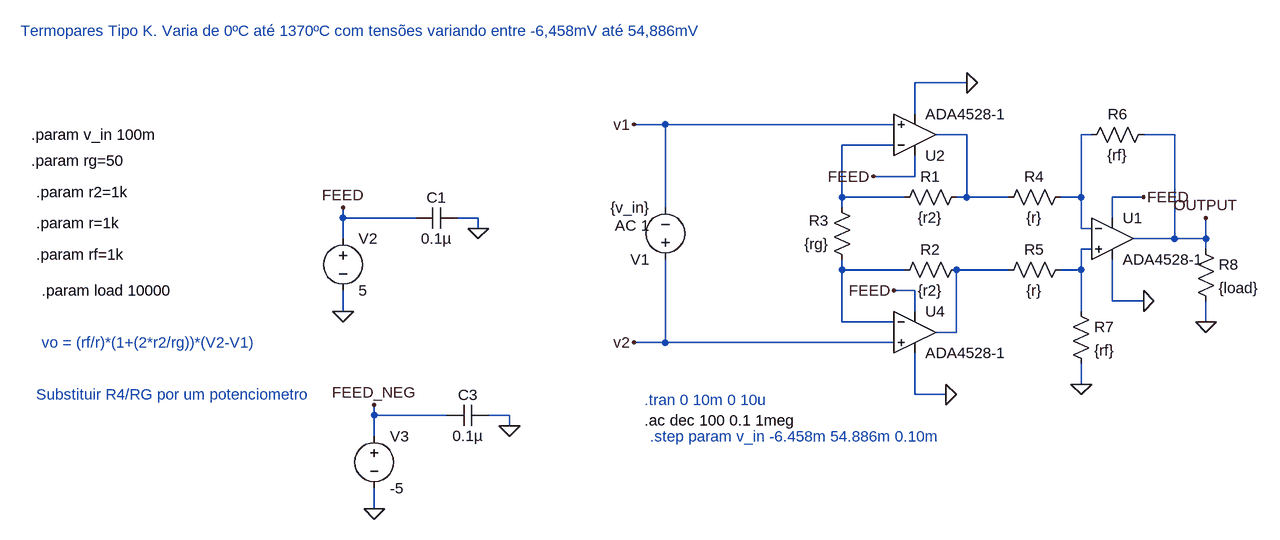
[diagram p0: schematic Amplificador_Instrumentacao_ADA4528_1.asc]
Amplificador_Instrumentacao_ADA4528_1.asc, the LTspice schematic file:
Version 4.1
SHEET 1 1372 680
WIRE 384 -160 304 -160
WIRE 304 -112 304 -160
WIRE -80 -96 -128 -96
WIRE 272 -96 -80 -96
WIRE 384 -80 336 -80
WIRE 576 -80 560 -80
WIRE 704 -80 656 -80
WIRE 272 -64 192 -64
WIRE 304 -16 304 -48
WIRE 304 -16 240 -16
WIRE 192 16 192 -64
WIRE 288 16 192 16
WIRE 384 16 384 -80
WIRE 384 16 368 16
WIRE 448 16 384 16
WIRE 560 16 560 -80
WIRE 560 16 528 16
WIRE 656 16 608 16
WIRE -80 32 -80 -96
WIRE 192 32 192 16
WIRE -576 48 -576 32
WIRE -464 48 -576 48
WIRE -368 48 -400 48
WIRE 608 48 608 16
WIRE -368 64 -368 48
WIRE 560 64 560 16
WIRE 576 64 560 64
WIRE -576 80 -576 48
WIRE 704 80 704 -80
WIRE 704 80 640 80
WIRE 752 80 752 48
WIRE 752 80 704 80
WIRE 576 96 560 96
WIRE 752 96 752 80
WIRE 192 128 192 112
WIRE 288 128 192 128
WIRE 448 128 368 128
WIRE 560 128 560 96
WIRE 560 128 528 128
WIRE 304 160 272 160
WIRE 608 176 608 112
WIRE 656 176 608 176
WIRE -576 192 -576 160
WIRE 304 192 304 160
WIRE 560 192 560 128
WIRE 192 208 192 128
WIRE 272 208 192 208
WIRE 752 208 752 176
WIRE 368 224 368 128
WIRE 368 224 336 224
WIRE -80 240 -80 112
WIRE -80 240 -128 240
WIRE 272 240 -80 240
WIRE 560 304 560 272
WIRE 304 320 304 256
WIRE 352 320 304 320
WIRE -528 352 -528 336
WIRE -416 352 -528 352
WIRE -320 352 -352 352
WIRE -320 368 -320 352
WIRE -528 384 -528 352
WIRE -528 496 -528 464
FLAG -576 32 FEED
FLAG -576 192 0
FLAG 560 304 0
FLAG 240 -16 FEED
FLAG 272 160 FEED
FLAG 656 16 FEED
FLAG 752 208 0
FLAG 752 48 OUTPUT
FLAG -128 240 v2
FLAG -128 -96 v1
FLAG -368 64 0
FLAG -528 336 FEED_NEG
FLAG -528 496 0
FLAG -320 368 0
FLAG 656 176 0
FLAG 352 320 0
FLAG 384 -160 0
SYMBOL res 384 0 R90
WINDOW 0 0 56 VBottom 2
WINDOW 3 32 56 VTop 2
SYMATTR InstName R1
SYMATTR Value {r2}
SYMBOL res 384 112 R90
WINDOW 0 0 56 VBottom 2
WINDOW 3 32 56 VTop 2
SYMATTR InstName R2
SYMATTR Value {r2}
SYMBOL res 208 128 R180
WINDOW 0 36 76 Left 2
WINDOW 3 36 40 Left 2
SYMATTR InstName R3
SYMATTR Value {rg}
SYMBOL res 432 32 R270
WINDOW 0 32 56 VTop 2
WINDOW 3 0 56 VBottom 2
SYMATTR InstName R4
SYMATTR Value {r}
SYMBOL res 432 144 R270
WINDOW 0 32 56 VTop 2
WINDOW 3 0 56 VBottom 2
SYMATTR InstName R5
SYMATTR Value {r}
SYMBOL res 560 -64 R270
WINDOW 0 32 56 VTop 2
WINDOW 3 0 56 VBottom 2
SYMATTR InstName R6
SYMATTR Value {rf}
SYMBOL res 544 176 R0
SYMATTR InstName R7
SYMATTR Value {rf}
SYMBOL voltage -80 128 R180
WINDOW 123 24 68 Left 2
WINDOW 39 0 0 Left 0
SYMATTR Value2 AC 1
SYMATTR InstName V1
SYMATTR Value {v_in}
SYMBOL res 736 80 R0
SYMATTR InstName R8
SYMATTR Value {load}
SYMBOL voltage -576 64 R0
WINDOW 123 0 0 Left 0
WINDOW 39 0 0 Left 0
SYMATTR InstName V2
SYMATTR Value 5
SYMBOL cap -400 32 R90
WINDOW 0 0 32 VBottom 2
WINDOW 3 32 32 VTop 2
SYMATTR InstName C1
SYMATTR Value 0.1µ
SYMBOL OpAmps\\ADA4528-1 304 160 R0
SYMATTR InstName U4
SYMBOL OpAmps\\ADA4528-1 608 16 R0
SYMATTR InstName U1
SYMBOL OpAmps\\ADA4528-1 304 -16 M180
SYMATTR InstName U2
SYMBOL voltage -528 368 R0
WINDOW 123 0 0 Left 0
WINDOW 39 0 0 Left 0
SYMATTR InstName V3
SYMATTR Value -5
SYMBOL cap -352 336 R90
WINDOW 0 0 32 VBottom 2
WINDOW 3 32 32 VTop 2
SYMATTR InstName C3
SYMATTR Value 0.1µ
TEXT -1056 -80 Left 2 !.param v_in 100m
TEXT -1056 -40 Left 2 !.param rg=50
TEXT -1048 8 Left 2 !.param r2=1k
TEXT -1048 56 Left 2 !.param r=1k
TEXT -1048 104 Left 2 !.param rf=1k
TEXT -1040 160 Left 2 !.param load 10000
TEXT -1040 240 Left 2 ;vo = (rf/r)*(1+(2*r2/rg))*(V2-V1)
TEXT -112 328 Left 2 ;.tran 0 10m 0 10u
TEXT -1048 320 Left 2 ;Substituir R4/RG por um potenciometro
TEXT -1072 -240 Left 2 ;Termopares Tipo K. Varia de 0ºC até 1370ºC com tensões variando entre -6,458mV até 54,886mV
TEXT -104 384 Left 2 ;.step param v_in -6.458m 54.886m 0.10m
TEXT -112 360 Left 2 !.ac dec 100 0.1 1meg

The netlist it stands for:
* Amplificador_Instrumentacao_ADA4528_1.asc
R1 N001 N003 {r2}
R2 N006 N005 {r2}
R3 N005 N003 {rg}
R4 N001 N002 {r}
R5 N006 N004 {r}
R6 N002 OUTPUT {rf}
R7 N004 0 {rf}
V1 v2 v1 {v_in} AC 1
R8 OUTPUT 0 {load}
V2 FEED 0 5
C1 0 FEED 0.1µ
X§U4 v2 N005 FEED 0 N006 ADA4528-1  ; pins In+ In- V+ V- OUT
X§U1 N004 N002 FEED 0 OUTPUT ADA4528-1  ; pins In+ In- V+ V- OUT
X§U2 v1 N003 FEED 0 N001 ADA4528-1  ; pins In+ In- V+ V- OUT
V3 FEED_NEG 0 -5
C3 0 FEED_NEG 0.1µ
.param v_in 100m
.param rg=50
.param r2=1k
.param r=1k
.param rf=1k
.param load 10000
* vo = (rf/r)*(1+(2*r2/rg))*(V2-V1)
* .tran 0 10m 0 10u
* Substituir R4/RG por um potenciometro
* Termopares Tipo K. Varia de 0ºC até 1370ºC com tensões variando entre -6,458mV até 54,886mV
* .step param v_in -6.458m 54.886m 0.10m
.ac dec 100 0.1 1meg
.backanno
.end

* Results of the author's LTspice run, read from the files saved beside the schematic
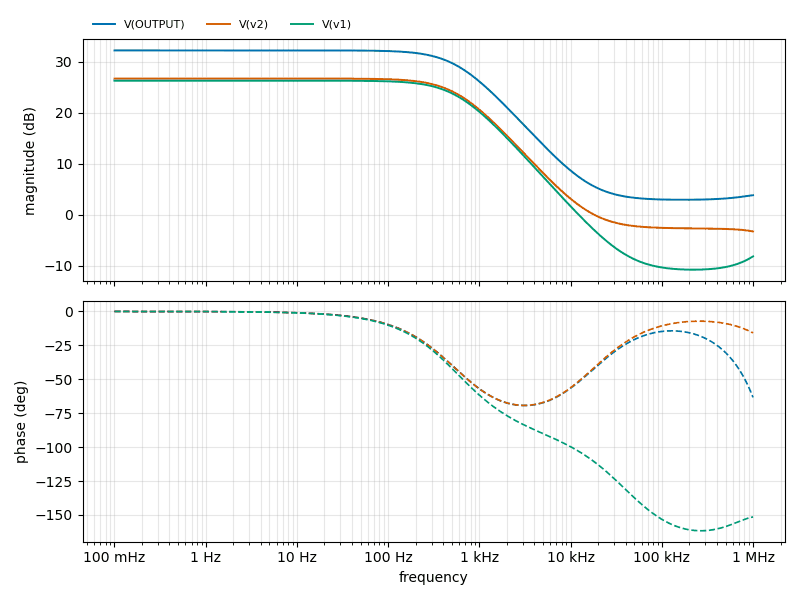
[diagram p1: AC Analysis of Amplificador_Instrumentacao_ADA4528_1.asc, plotted from the saved traces]
* AC Analysis, 1 run:
*   V(OUTPUT): 32.25 dB at 100 mHz, 3.82 dB at 1 MHz, peak 32.25 dB at 100 mHz, 3 dB below the peak at 569.6 Hz
*   V(v2): 26.72 dB at 100 mHz, -3.30 dB at 1 MHz, peak 26.72 dB at 100 mHz, 3 dB below the peak at 569.6 Hz
*   V(v1): 26.31 dB at 100 mHz, -8.19 dB at 1 MHz, peak 26.31 dB at 100 mHz, 3 dB below the peak at 569.1 Hz